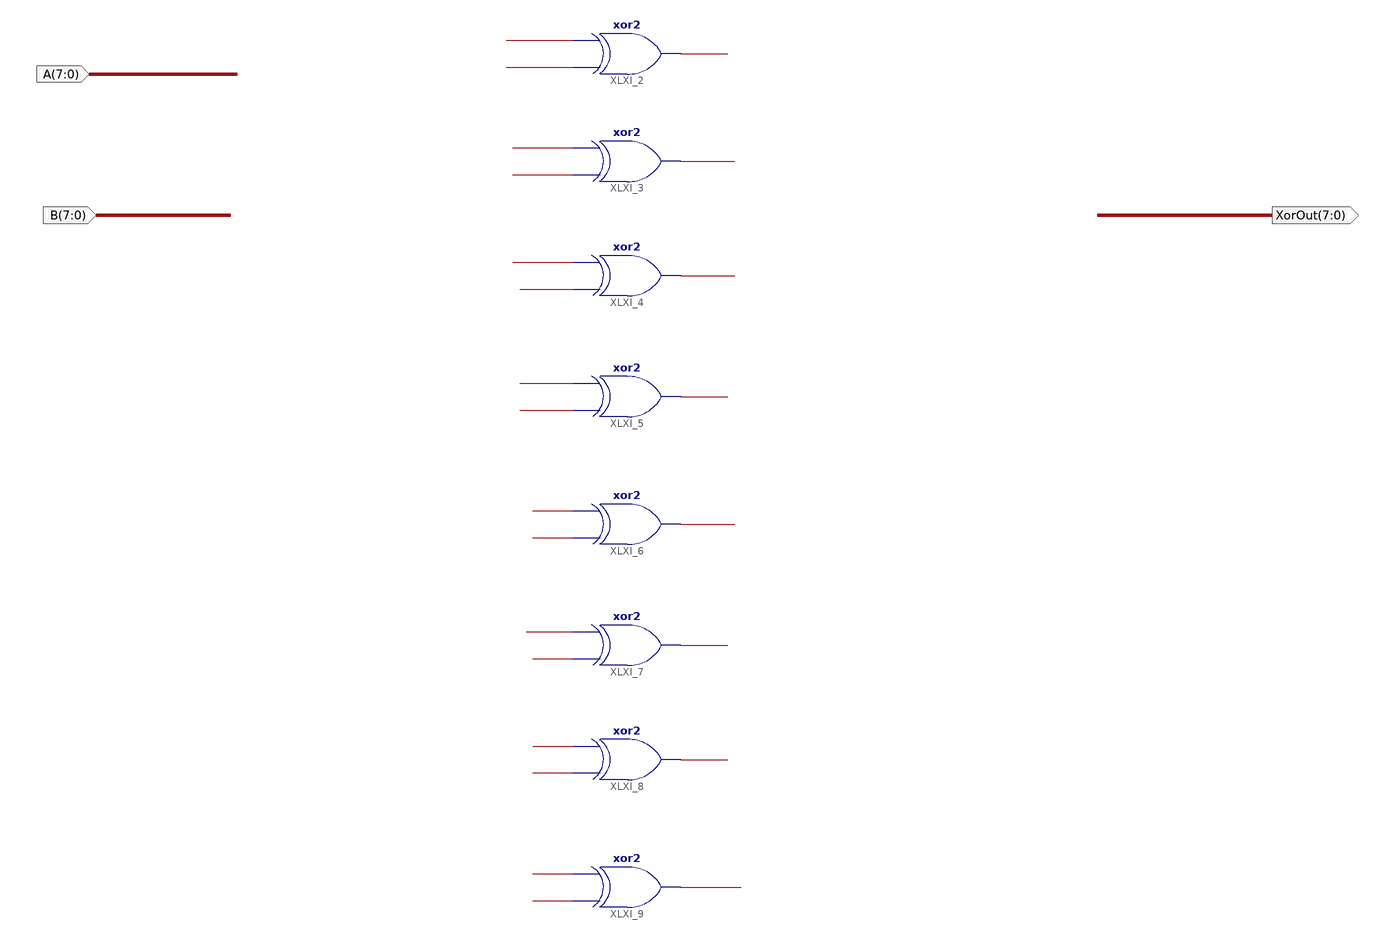
[diagram p0: schematic sheet 1]
// Xilinx ISE schematic EightBitXor.sch (spartan6) as structural Verilog: 8 symbols, 3 ports
module EightBitXor (
  input  [7:0] A,
  input  [7:0] B,
  output [7:0] XorOut
);

  xor XLXI_2 (XorOut[0], B[0], A[0]);
  xor XLXI_3 (XorOut[1], B[1], A[1]);
  xor XLXI_4 (XorOut[2], B[2], A[2]);
  xor XLXI_5 (XorOut[3], B[3], A[3]);
  xor XLXI_6 (XorOut[4], B[4], A[4]);
  xor XLXI_7 (XorOut[5], B[5], A[5]);
  xor XLXI_8 (XorOut[6], B[6], A[6]);
  xor XLXI_9 (XorOut[7], B[7], A[7]);
endmodule
